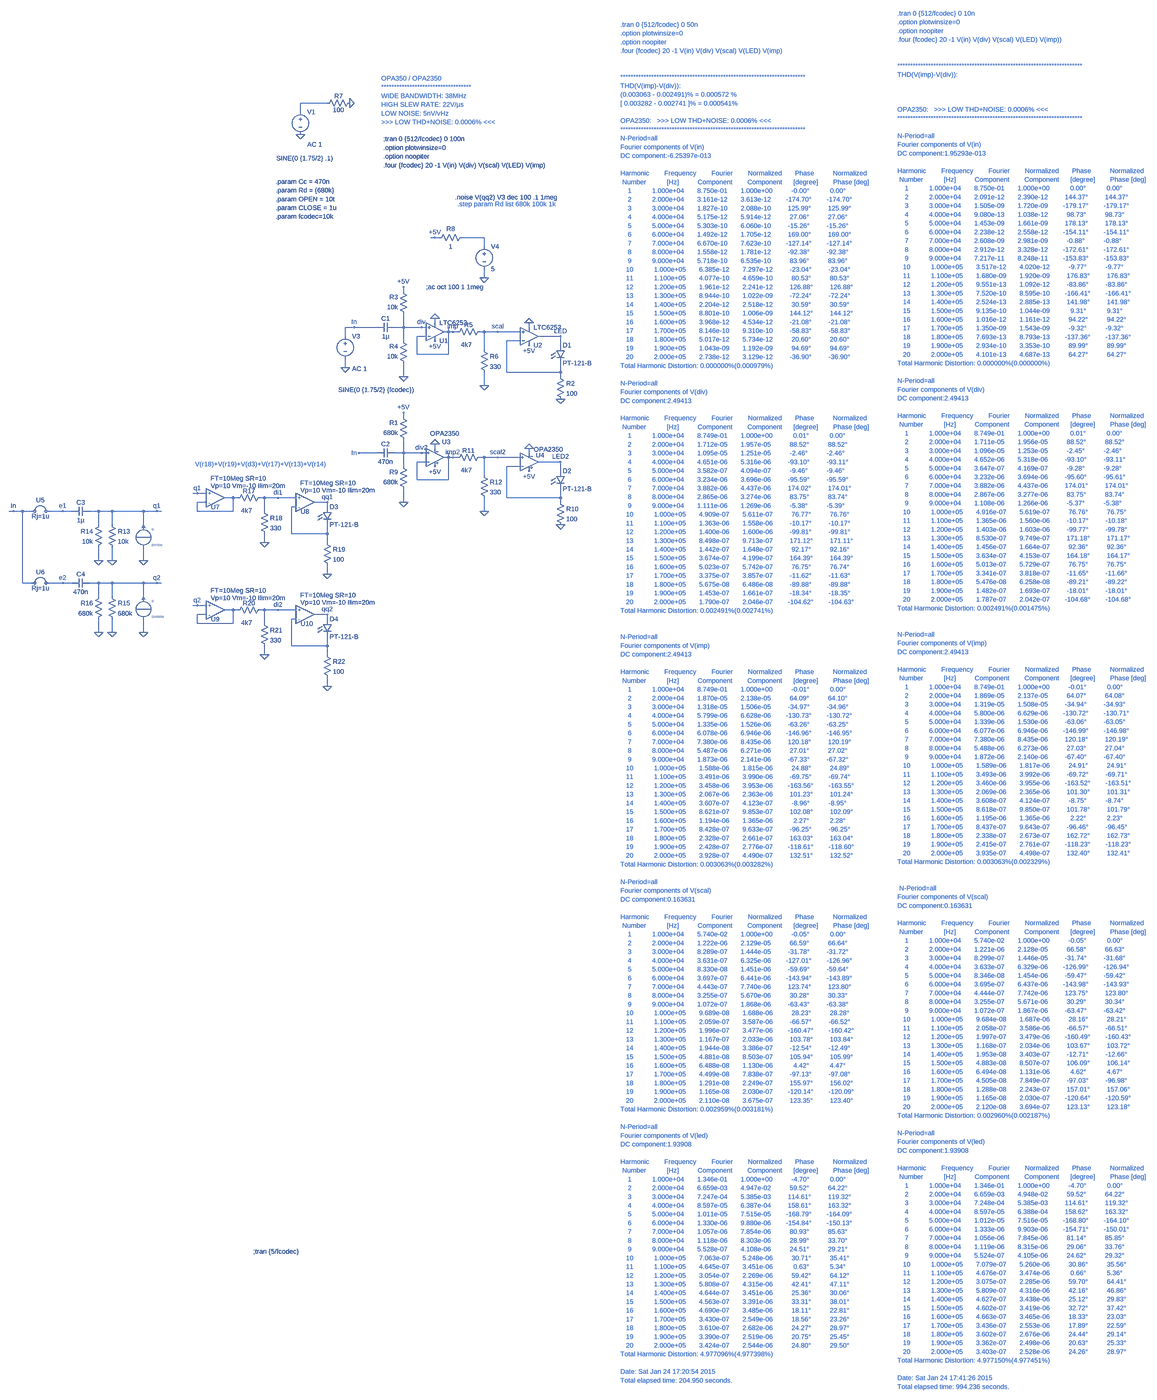
[diagram p0: schematic ALDO_LED_Driver_opa2350_thd.asc, whole sheet]
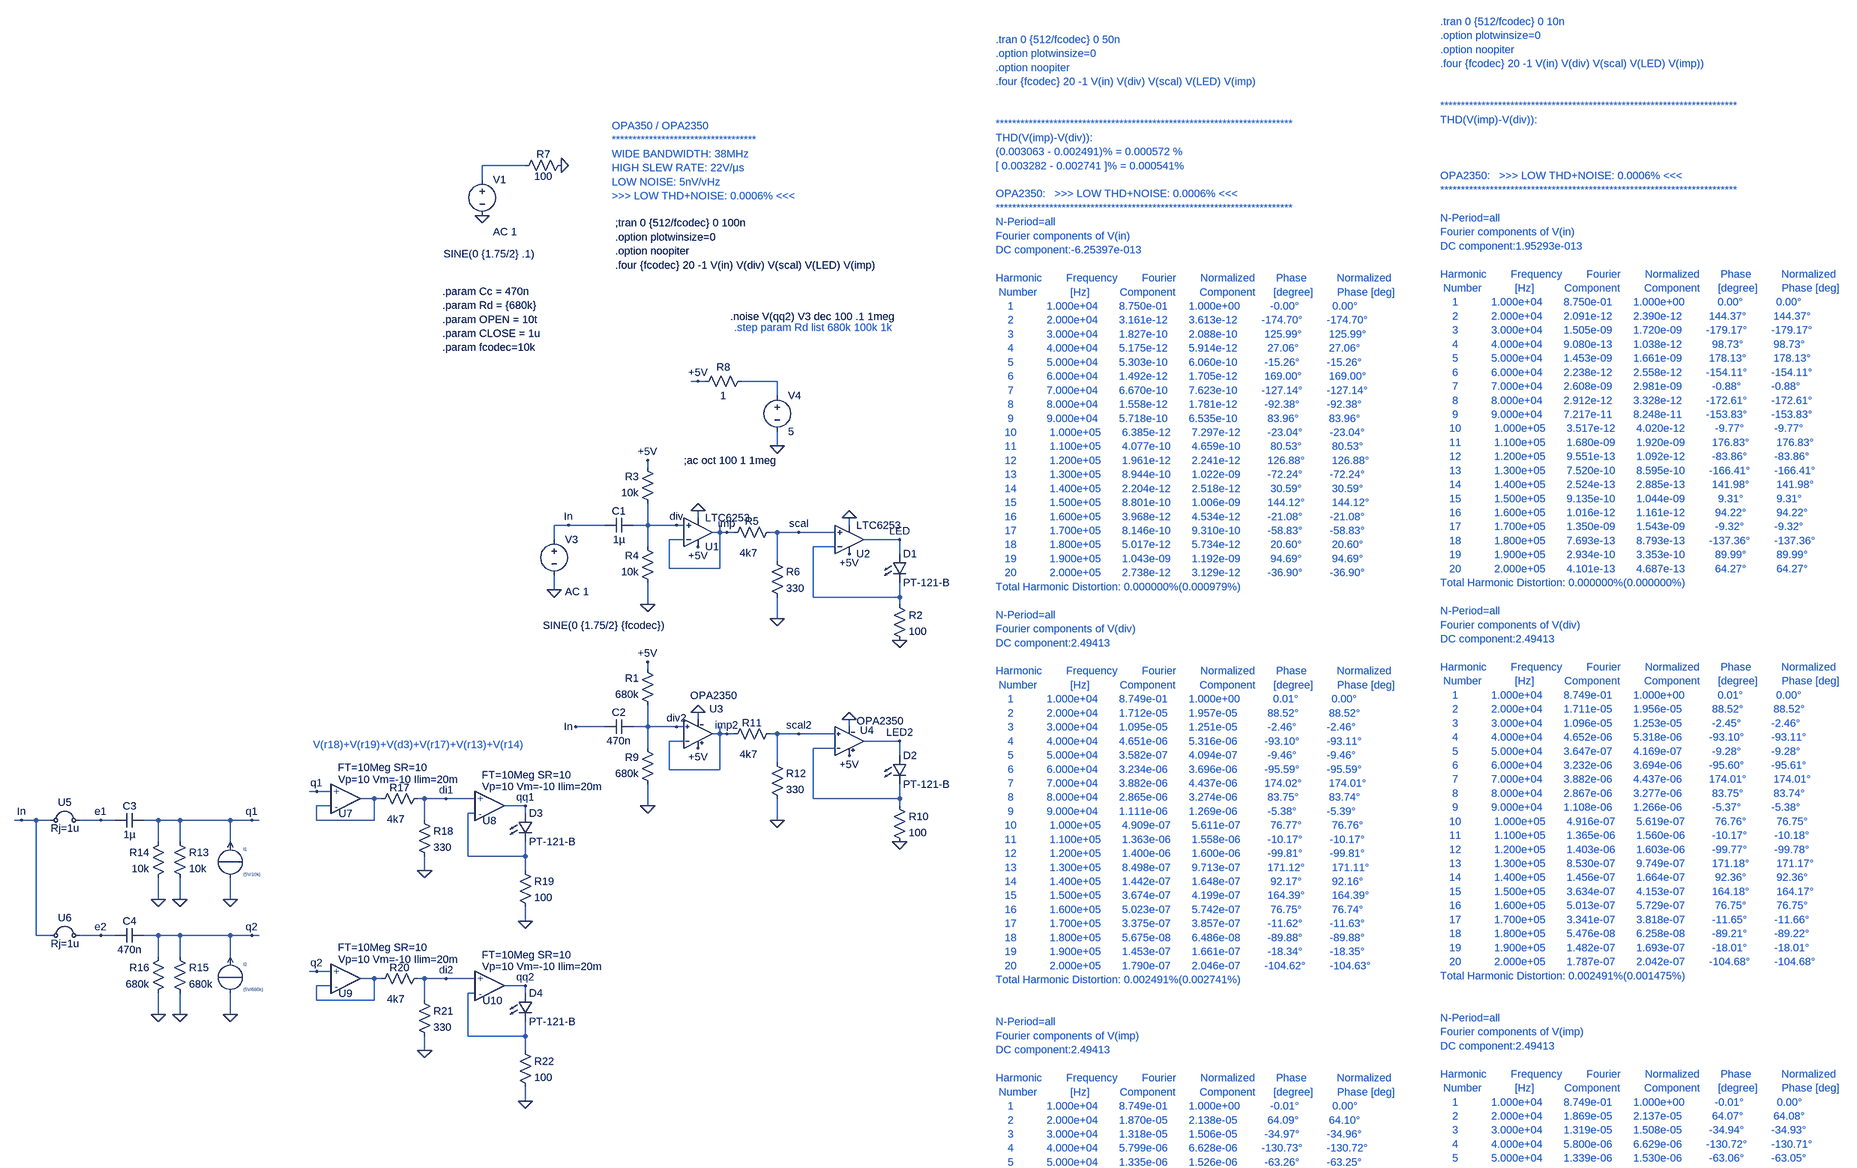
[diagram p1: schematic ALDO_LED_Driver_opa2350_thd.asc, part, row 1 of 2, column 1 of 1]
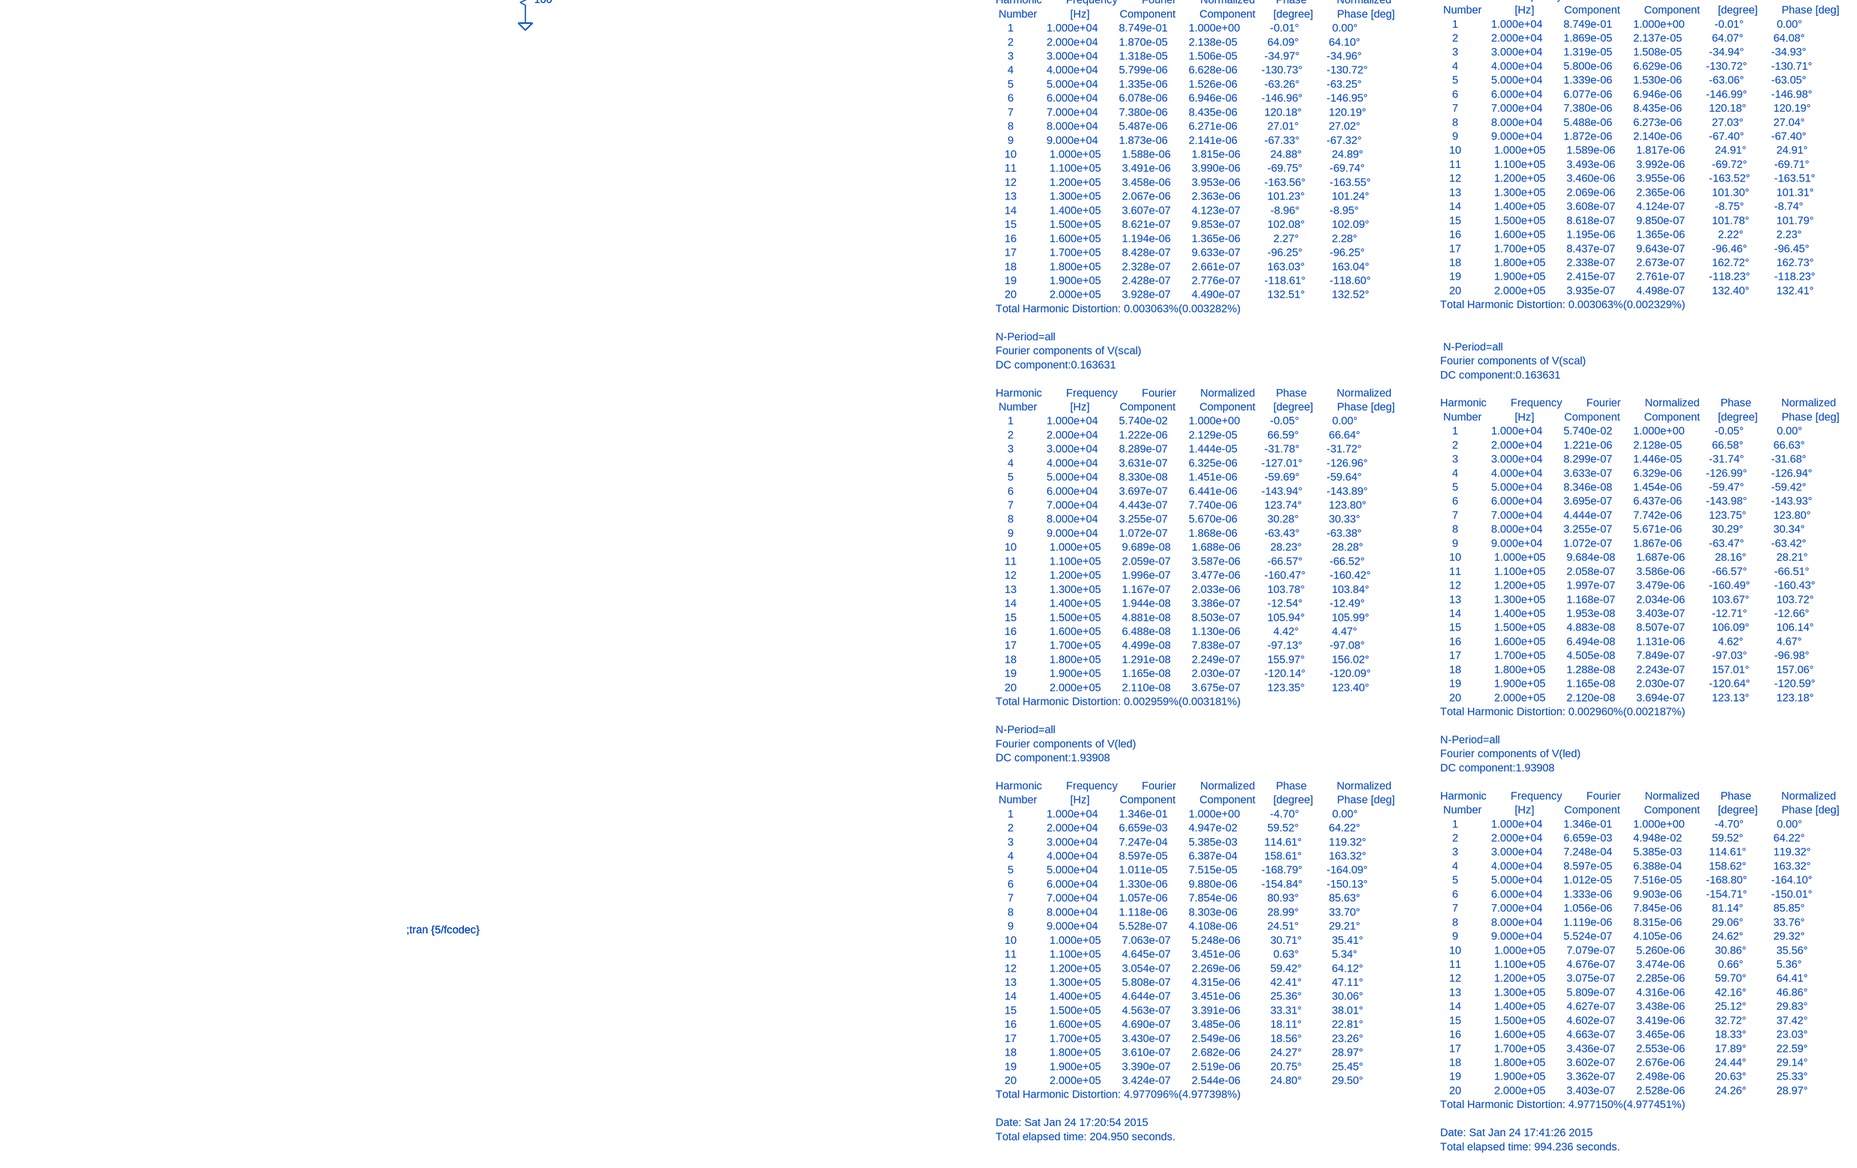
[diagram p2: schematic ALDO_LED_Driver_opa2350_thd.asc, part, row 2 of 2, column 1 of 1]
* ALDO_LED_Driver_opa2350_thd.asc
V3 In 0 SINE(0 {1.75/2} {fcodec}) AC 1
V4 N002 0 5
R3 div +5V 10k
D1 LED N003 PT-121-B
R2 N003 0 100
C1 div In 1µ
R5 imp scal 4k7
R6 scal 0 330
V1 N001 0 SINE(0 {1.75/2} .1) AC 1
R7 0 N001 100
R8 +5V N002 1
R1 div2 +5V 680k
R9 0 div2 680k
R10 N004 0 100
C2 div2 In 470n
R11 imp2 scal2 4k7
R12 scal2 0 330
D2 LED2 N004 PT-121-B
XU3 div2 imp2 +5V 0 imp2 OPA2350 OPA2350  ; pins In+ In- V+ V- OUT
XU4 scal2 N004 +5V 0 LED2 OPA2350 OPA2350  ; pins In+ In- V+ V- OUT
R4 0 div 10k
* U1: LTC6253 (symbol Opamps\LTC6253 not available, pins judged from their places): In+=div In-=imp V+=+5V V-=0 OUT=imp
* U2: LTC6253 (symbol Opamps\LTC6253 not available, pins judged from their places): In+=scal In-=N003 V+=+5V V-=0 OUT=LED
C3 q1 e1 1µ
I1 0 q1 {5V/10k}
C4 q2 e2 470n
I2 0 q2 {5V/680k}
R13 q1 0 10k
R14 q1 0 10k
R15 q2 0 680k
R16 q2 0 680k
XU5 In e1 jumperResistor Rin=1t Rout=1t Rj=1u  ; pins + -
XU6 In e2 jumperResistor Rin=1t Rout=1t Rj=1u  ; pins + -
XU7 q1 N005 N005 opamp_param_3 Vp=10 Vm=-10 Ilim=20m FT=10Meg SR=10 Vos=0 A0=100k phir=45 en=0 enk=0 in=0 ink=0 Rin=500Meg  ; pins In+ In- OUT
XU8 di1 N006 qq1 opamp_param_3 Vp=10 Vm=-10 Ilim=20m FT=10Meg SR=10 Vos=0 A0=100k phir=45 en=0 enk=0 in=0 ink=0 Rin=500Meg  ; pins In+ In- OUT
D3 qq1 N006 PT-121-B
R17 N005 di1 4k7
R18 di1 0 330
R19 N006 0 100
XU9 q2 N007 N007 opamp_param_3 Vp=10 Vm=-10 Ilim=20m FT=10Meg SR=10 Vos=0 A0=100k phir=45 en=0 enk=0 in=0 ink=0 Rin=500Meg  ; pins In+ In- OUT
XU10 di2 N008 qq2 opamp_param_3 Vp=10 Vm=-10 Ilim=20m FT=10Meg SR=10 Vos=0 A0=100k phir=45 en=0 enk=0 in=0 ink=0 Rin=500Meg  ; pins In+ In- OUT
D4 qq2 N008 PT-121-B
R20 N007 di2 4k7
R21 di2 0 330
R22 N008 0 100
.model D D
.lib standard.dio
.param Cc = 470n
.param Rd = {680k}
.param OPEN = 10t
.param CLOSE = 1u
.param fcodec=10k
;tran 0 {512/fcodec} 0 100n
.option plotwinsize=0
.option noopiter
.four {fcodec} 20 -1 V(in) V(div) V(scal) V(LED) V(imp)
* .tran 0 {512/fcodec} 0 50n
* .option plotwinsize=0
* .option noopiter
* .four {fcodec} 20 -1 V(in) V(div) V(scal) V(LED) V(imp)
* ************************************************************************
* THD(V(imp)-V(div)):
* (0.003063 - 0.002491)% = 0.000572 %
* [ 0.003282 - 0.002741 ]% = 0.000541%
* OPA2350:   >>> LOW THD+NOISE: 0.0006% <<<
* ************************************************************************
* N-Period=all
* Fourier components of V(in)
* DC component:-6.25397e-013
* Harmonic        Frequency        Fourier        Normalized       Phase          Normalized
*  Number           [Hz]          Component        Component      [degree]        Phase [deg]
*     1           1.000e+04       8.750e-01       1.000e+00          -0.00°           0.00°
*     2           2.000e+04       3.161e-12       3.613e-12        -174.70°        -174.70°
*     3           3.000e+04       1.827e-10       2.088e-10         125.99°         125.99°
*     4           4.000e+04       5.175e-12       5.914e-12          27.06°          27.06°
*     5           5.000e+04       5.303e-10       6.060e-10         -15.26°         -15.26°
*     6           6.000e+04       1.492e-12       1.705e-12         169.00°         169.00°
*     7           7.000e+04       6.670e-10       7.623e-10        -127.14°        -127.14°
*     8           8.000e+04       1.558e-12       1.781e-12         -92.38°         -92.38°
*     9           9.000e+04       5.718e-10       6.535e-10          83.96°          83.96°
*    10           1.000e+05       6.385e-12       7.297e-12         -23.04°         -23.04°
*    11           1.100e+05       4.077e-10       4.659e-10          80.53°          80.53°
*    12           1.200e+05       1.961e-12       2.241e-12         126.88°         126.88°
*    13           1.300e+05       8.944e-10       1.022e-09         -72.24°         -72.24°
*    14           1.400e+05       2.204e-12       2.518e-12          30.59°          30.59°
*    15           1.500e+05       8.801e-10       1.006e-09         144.12°         144.12°
*    16           1.600e+05       3.968e-12       4.534e-12         -21.08°         -21.08°
*    17           1.700e+05       8.146e-10       9.310e-10         -58.83°         -58.83°
*    18           1.800e+05       5.017e-12       5.734e-12          20.60°          20.60°
*    19           1.900e+05       1.043e-09       1.192e-09          94.69°          94.69°
*    20           2.000e+05       2.738e-12       3.129e-12         -36.90°         -36.90°
* Total Harmonic Distortion: 0.000000%(0.000979%)
* N-Period=all
* Fourier components of V(div)
* DC component:2.49413
* Harmonic        Frequency        Fourier        Normalized       Phase          Normalized
*  Number           [Hz]          Component        Component      [degree]        Phase [deg]
*     1           1.000e+04       8.749e-01       1.000e+00           0.01°           0.00°
*     2           2.000e+04       1.712e-05       1.957e-05          88.52°          88.52°
*     3           3.000e+04       1.095e-05       1.251e-05          -2.46°          -2.46°
*     4           4.000e+04       4.651e-06       5.316e-06         -93.10°         -93.11°
*     5           5.000e+04       3.582e-07       4.094e-07          -9.46°          -9.46°
*     6           6.000e+04       3.234e-06       3.696e-06         -95.59°         -95.59°
*     7           7.000e+04       3.882e-06       4.437e-06         174.02°         174.01°
*     8           8.000e+04       2.865e-06       3.274e-06          83.75°          83.74°
*     9           9.000e+04       1.111e-06       1.269e-06          -5.38°          -5.39°
*    10           1.000e+05       4.909e-07       5.611e-07          76.77°          76.76°
*    11           1.100e+05       1.363e-06       1.558e-06         -10.17°         -10.17°
*    12           1.200e+05       1.400e-06       1.600e-06         -99.81°         -99.81°
*    13           1.300e+05       8.498e-07       9.713e-07         171.12°         171.11°
*    14           1.400e+05       1.442e-07       1.648e-07          92.17°          92.16°
*    15           1.500e+05       3.674e-07       4.199e-07         164.39°         164.39°
*    16           1.600e+05       5.023e-07       5.742e-07          76.75°          76.74°
*    17           1.700e+05       3.375e-07       3.857e-07         -11.62°         -11.63°
*    18           1.800e+05       5.675e-08       6.486e-08         -89.88°         -89.88°
*    19           1.900e+05       1.453e-07       1.661e-07         -18.34°         -18.35°
*    20           2.000e+05       1.790e-07       2.046e-07        -104.62°        -104.63°
* Total Harmonic Distortion: 0.002491%(0.002741%)
* N-Period=all
* Fourier components of V(imp)
* DC component:2.49413
* Harmonic        Frequency        Fourier        Normalized       Phase          Normalized
*  Number           [Hz]          Component        Component      [degree]        Phase [deg]
*     1           1.000e+04       8.749e-01       1.000e+00          -0.01°           0.00°
*     2           2.000e+04       1.870e-05       2.138e-05          64.09°          64.10°
*     3           3.000e+04       1.318e-05       1.506e-05         -34.97°         -34.96°
*     4           4.000e+04       5.799e-06       6.628e-06        -130.73°        -130.72°
*     5           5.000e+04       1.335e-06       1.526e-06         -63.26°         -63.25°
*     6           6.000e+04       6.078e-06       6.946e-06        -146.96°        -146.95°
*     7           7.000e+04       7.380e-06       8.435e-06         120.18°         120.19°
*     8           8.000e+04       5.487e-06       6.271e-06          27.01°          27.02°
*     9           9.000e+04       1.873e-06       2.141e-06         -67.33°         -67.32°
*    10           1.000e+05       1.588e-06       1.815e-06          24.88°          24.89°
*    11           1.100e+05       3.491e-06       3.990e-06         -69.75°         -69.74°
*    12           1.200e+05       3.458e-06       3.953e-06        -163.56°        -163.55°
*    13           1.300e+05       2.067e-06       2.363e-06         101.23°         101.24°
*    14           1.400e+05       3.607e-07       4.123e-07          -8.96°          -8.95°
*    15           1.500e+05       8.621e-07       9.853e-07         102.08°         102.09°
*    16           1.600e+05       1.194e-06       1.365e-06           2.27°           2.28°
*    17           1.700e+05       8.428e-07       9.633e-07         -96.25°         -96.25°
*    18           1.800e+05       2.328e-07       2.661e-07         163.03°         163.04°
*    19           1.900e+05       2.428e-07       2.776e-07        -118.61°        -118.60°
*    20           2.000e+05       3.928e-07       4.490e-07         132.51°         132.52°
* Total Harmonic Distortion: 0.003063%(0.003282%)
* N-Period=all
* Fourier components of V(scal)
* DC component:0.163631
* Harmonic        Frequency        Fourier        Normalized       Phase          Normalized
*  Number           [Hz]          Component        Component      [degree]        Phase [deg]
*     1           1.000e+04       5.740e-02       1.000e+00          -0.05°           0.00°
*     2           2.000e+04       1.222e-06       2.129e-05          66.59°          66.64°
*     3           3.000e+04       8.289e-07       1.444e-05         -31.78°         -31.72°
*     4           4.000e+04       3.631e-07       6.325e-06        -127.01°        -126.96°
*     5           5.000e+04       8.330e-08       1.451e-06         -59.69°         -59.64°
*     6           6.000e+04       3.697e-07       6.441e-06        -143.94°        -143.89°
*     7           7.000e+04       4.443e-07       7.740e-06         123.74°         123.80°
*     8           8.000e+04       3.255e-07       5.670e-06          30.28°          30.33°
*     9           9.000e+04       1.072e-07       1.868e-06         -63.43°         -63.38°
*    10           1.000e+05       9.689e-08       1.688e-06          28.23°          28.28°
*    11           1.100e+05       2.059e-07       3.587e-06         -66.57°         -66.52°
*    12           1.200e+05       1.996e-07       3.477e-06        -160.47°        -160.42°
*    13           1.300e+05       1.167e-07       2.033e-06         103.78°         103.84°
*    14           1.400e+05       1.944e-08       3.386e-07         -12.54°         -12.49°
*    15           1.500e+05       4.881e-08       8.503e-07         105.94°         105.99°
*    16           1.600e+05       6.488e-08       1.130e-06           4.42°           4.47°
*    17           1.700e+05       4.499e-08       7.838e-07         -97.13°         -97.08°
*    18           1.800e+05       1.291e-08       2.249e-07         155.97°         156.02°
*    19           1.900e+05       1.165e-08       2.030e-07        -120.14°        -120.09°
*    20           2.000e+05       2.110e-08       3.675e-07         123.35°         123.40°
* Total Harmonic Distortion: 0.002959%(0.003181%)
* N-Period=all
* Fourier components of V(led)
* DC component:1.93908
* Harmonic        Frequency        Fourier        Normalized       Phase          Normalized
*  Number           [Hz]          Component        Component      [degree]        Phase [deg]
*     1           1.000e+04       1.346e-01       1.000e+00          -4.70°           0.00°
*     2           2.000e+04       6.659e-03       4.947e-02          59.52°          64.22°
*     3           3.000e+04       7.247e-04       5.385e-03         114.61°         119.32°
*     4           4.000e+04       8.597e-05       6.387e-04         158.61°         163.32°
*     5           5.000e+04       1.011e-05       7.515e-05        -168.79°        -164.09°
*     6           6.000e+04       1.330e-06       9.880e-06        -154.84°        -150.13°
*     7           7.000e+04       1.057e-06       7.854e-06          80.93°          85.63°
*     8           8.000e+04       1.118e-06       8.303e-06          28.99°          33.70°
*     9           9.000e+04       5.528e-07       4.108e-06          24.51°          29.21°
*    10           1.000e+05       7.063e-07       5.248e-06          30.71°          35.41°
*    11           1.100e+05       4.645e-07       3.451e-06           0.63°           5.34°
*    12           1.200e+05       3.054e-07       2.269e-06          59.42°          64.12°
*    13           1.300e+05       5.808e-07       4.315e-06          42.41°          47.11°
*    14           1.400e+05       4.644e-07       3.451e-06          25.36°          30.06°
*    15           1.500e+05       4.563e-07       3.391e-06          33.31°          38.01°
*    16           1.600e+05       4.690e-07       3.485e-06          18.11°          22.81°
*    17           1.700e+05       3.430e-07       2.549e-06          18.56°          23.26°
*    18           1.800e+05       3.610e-07       2.682e-06          24.27°          28.97°
*    19           1.900e+05       3.390e-07       2.519e-06          20.75°          25.45°
*    20           2.000e+05       3.424e-07       2.544e-06          24.80°          29.50°
* Total Harmonic Distortion: 4.977096%(4.977398%)
* Date: Sat Jan 24 17:20:54 2015
* Total elapsed time: 204.950 seconds.
* OPA350 / OPA2350
* ***********************************
* WIDE BANDWIDTH: 38MHz
* HIGH SLEW RATE: 22V/µs
* LOW NOISE: 5nV/vHz
* >>> LOW THD+NOISE: 0.0006% <<<
* .tran 0 {512/fcodec} 0 10n
* .option plotwinsize=0
* .option noopiter
* .four {fcodec} 20 -1 V(in) V(div) V(scal) V(LED) V(imp))
* ************************************************************************
* THD(V(imp)-V(div)):
* OPA2350:   >>> LOW THD+NOISE: 0.0006% <<<
* ************************************************************************
* N-Period=all
* Fourier components of V(in)
* DC component:1.95293e-013
* Harmonic        Frequency        Fourier        Normalized       Phase          Normalized
*  Number           [Hz]          Component        Component      [degree]        Phase [deg]
*     1           1.000e+04       8.750e-01       1.000e+00           0.00°           0.00°
*     2           2.000e+04       2.091e-12       2.390e-12         144.37°         144.37°
*     3           3.000e+04       1.505e-09       1.720e-09        -179.17°        -179.17°
*     4           4.000e+04       9.080e-13       1.038e-12          98.73°          98.73°
*     5           5.000e+04       1.453e-09       1.661e-09         178.13°         178.13°
*     6           6.000e+04       2.238e-12       2.558e-12        -154.11°        -154.11°
*     7           7.000e+04       2.608e-09       2.981e-09          -0.88°          -0.88°
*     8           8.000e+04       2.912e-12       3.328e-12        -172.61°        -172.61°
*     9           9.000e+04       7.217e-11       8.248e-11        -153.83°        -153.83°
*    10           1.000e+05       3.517e-12       4.020e-12          -9.77°          -9.77°
*    11           1.100e+05       1.680e-09       1.920e-09         176.83°         176.83°
*    12           1.200e+05       9.551e-13       1.092e-12         -83.86°         -83.86°
*    13           1.300e+05       7.520e-10       8.595e-10        -166.41°        -166.41°
*    14           1.400e+05       2.524e-13       2.885e-13         141.98°         141.98°
*    15           1.500e+05       9.135e-10       1.044e-09           9.31°           9.31°
*    16           1.600e+05       1.016e-12       1.161e-12          94.22°          94.22°
*    17           1.700e+05       1.350e-09       1.543e-09          -9.32°          -9.32°
*    18           1.800e+05       7.693e-13       8.793e-13        -137.36°        -137.36°
*    19           1.900e+05       2.934e-10       3.353e-10          89.99°          89.99°
*    20           2.000e+05       4.101e-13       4.687e-13          64.27°          64.27°
* Total Harmonic Distortion: 0.000000%(0.000000%)
* N-Period=all
* Fourier components of V(div)
* DC component:2.49413
* Harmonic        Frequency        Fourier        Normalized       Phase          Normalized
*  Number           [Hz]          Component        Component      [degree]        Phase [deg]
*     1           1.000e+04       8.749e-01       1.000e+00           0.01°           0.00°
*     2           2.000e+04       1.711e-05       1.956e-05          88.52°          88.52°
*     3           3.000e+04       1.096e-05       1.253e-05          -2.45°          -2.46°
*     4           4.000e+04       4.652e-06       5.318e-06         -93.10°         -93.11°
*     5           5.000e+04       3.647e-07       4.169e-07          -9.28°          -9.28°
*     6           6.000e+04       3.232e-06       3.694e-06         -95.60°         -95.61°
*     7           7.000e+04       3.882e-06       4.437e-06         174.01°         174.01°
*     8           8.000e+04       2.867e-06       3.277e-06          83.75°          83.74°
*     9           9.000e+04       1.108e-06       1.266e-06          -5.37°          -5.38°
*    10           1.000e+05       4.916e-07       5.619e-07          76.76°          76.75°
*    11           1.100e+05       1.365e-06       1.560e-06         -10.17°         -10.18°
*    12           1.200e+05       1.403e-06       1.603e-06         -99.77°         -99.78°
*    13           1.300e+05       8.530e-07       9.749e-07         171.18°         171.17°
*    14           1.400e+05       1.456e-07       1.664e-07          92.36°          92.36°
*    15           1.500e+05       3.634e-07       4.153e-07         164.18°         164.17°
*    16           1.600e+05       5.013e-07       5.729e-07          76.75°          76.75°
*    17           1.700e+05       3.341e-07       3.818e-07         -11.65°         -11.66°
*    18           1.800e+05       5.476e-08       6.258e-08         -89.21°         -89.22°
*    19           1.900e+05       1.482e-07       1.693e-07         -18.01°         -18.01°
*    20           2.000e+05       1.787e-07       2.042e-07        -104.68°        -104.68°
* Total Harmonic Distortion: 0.002491%(0.001475%)
* N-Period=all
* Fourier components of V(imp)
* DC component:2.49413
* Harmonic        Frequency        Fourier        Normalized       Phase          Normalized
*  Number           [Hz]          Component        Component      [degree]        Phase [deg]
*     1           1.000e+04       8.749e-01       1.000e+00          -0.01°           0.00°
*     2           2.000e+04       1.869e-05       2.137e-05          64.07°          64.08°
*     3           3.000e+04       1.319e-05       1.508e-05         -34.94°         -34.93°
*     4           4.000e+04       5.800e-06       6.629e-06        -130.72°        -130.71°
*     5           5.000e+04       1.339e-06       1.530e-06         -63.06°         -63.05°
*     6           6.000e+04       6.077e-06       6.946e-06        -146.99°        -146.98°
*     7           7.000e+04       7.380e-06       8.435e-06         120.18°         120.19°
*     8           8.000e+04       5.488e-06       6.273e-06          27.03°          27.04°
*     9           9.000e+04       1.872e-06       2.140e-06         -67.40°         -67.40°
*    10           1.000e+05       1.589e-06       1.817e-06          24.91°          24.91°
*    11           1.100e+05       3.493e-06       3.992e-06         -69.72°         -69.71°
*    12           1.200e+05       3.460e-06       3.955e-06        -163.52°        -163.51°
*    13           1.300e+05       2.069e-06       2.365e-06         101.30°         101.31°
*    14           1.400e+05       3.608e-07       4.124e-07          -8.75°          -8.74°
*    15           1.500e+05       8.618e-07       9.850e-07         101.78°         101.79°
*    16           1.600e+05       1.195e-06       1.365e-06           2.22°           2.23°
*    17           1.700e+05       8.437e-07       9.643e-07         -96.46°         -96.45°
*    18           1.800e+05       2.338e-07       2.673e-07         162.72°         162.73°
*    19           1.900e+05       2.415e-07       2.761e-07        -118.23°        -118.23°
*    20           2.000e+05       3.935e-07       4.498e-07         132.40°         132.41°
* Total Harmonic Distortion: 0.003063%(0.002329%)
*  N-Period=all
* Fourier components of V(scal)
* DC component:0.163631
* Harmonic        Frequency        Fourier        Normalized       Phase          Normalized
*  Number           [Hz]          Component        Component      [degree]        Phase [deg]
*     1           1.000e+04       5.740e-02       1.000e+00          -0.05°           0.00°
*     2           2.000e+04       1.221e-06       2.128e-05          66.58°          66.63°
*     3           3.000e+04       8.299e-07       1.446e-05         -31.74°         -31.68°
*     4           4.000e+04       3.633e-07       6.329e-06        -126.99°        -126.94°
*     5           5.000e+04       8.346e-08       1.454e-06         -59.47°         -59.42°
*     6           6.000e+04       3.695e-07       6.437e-06        -143.98°        -143.93°
*     7           7.000e+04       4.444e-07       7.742e-06         123.75°         123.80°
*     8           8.000e+04       3.255e-07       5.671e-06          30.29°          30.34°
*     9           9.000e+04       1.072e-07       1.867e-06         -63.47°         -63.42°
*    10           1.000e+05       9.684e-08       1.687e-06          28.16°          28.21°
*    11           1.100e+05       2.058e-07       3.586e-06         -66.57°         -66.51°
*    12           1.200e+05       1.997e-07       3.479e-06        -160.49°        -160.43°
*    13           1.300e+05       1.168e-07       2.034e-06         103.67°         103.72°
*    14           1.400e+05       1.953e-08       3.403e-07         -12.71°         -12.66°
*    15           1.500e+05       4.883e-08       8.507e-07         106.09°         106.14°
*    16           1.600e+05       6.494e-08       1.131e-06           4.62°           4.67°
*    17           1.700e+05       4.505e-08       7.849e-07         -97.03°         -96.98°
*    18           1.800e+05       1.288e-08       2.243e-07         157.01°         157.06°
*    19           1.900e+05       1.165e-08       2.030e-07        -120.64°        -120.59°
*    20           2.000e+05       2.120e-08       3.694e-07         123.13°         123.18°
* Total Harmonic Distortion: 0.002960%(0.002187%)
* N-Period=all
* Fourier components of V(led)
* DC component:1.93908
* Harmonic        Frequency        Fourier        Normalized       Phase          Normalized
*  Number           [Hz]          Component        Component      [degree]        Phase [deg]
*     1           1.000e+04       1.346e-01       1.000e+00          -4.70°           0.00°
*     2           2.000e+04       6.659e-03       4.948e-02          59.52°          64.22°
*     3           3.000e+04       7.248e-04       5.385e-03         114.61°         119.32°
*     4           4.000e+04       8.597e-05       6.388e-04         158.62°         163.32°
*     5           5.000e+04       1.012e-05       7.516e-05        -168.80°        -164.10°
*     6           6.000e+04       1.333e-06       9.903e-06        -154.71°        -150.01°
*     7           7.000e+04       1.056e-06       7.845e-06          81.14°          85.85°
*     8           8.000e+04       1.119e-06       8.315e-06          29.06°          33.76°
*     9           9.000e+04       5.524e-07       4.105e-06          24.62°          29.32°
*    10           1.000e+05       7.079e-07       5.260e-06          30.86°          35.56°
*    11           1.100e+05       4.676e-07       3.474e-06           0.66°           5.36°
*    12           1.200e+05       3.075e-07       2.285e-06          59.70°          64.41°
*    13           1.300e+05       5.809e-07       4.316e-06          42.16°          46.86°
*    14           1.400e+05       4.627e-07       3.438e-06          25.12°          29.83°
*    15           1.500e+05       4.602e-07       3.419e-06          32.72°          37.42°
*    16           1.600e+05       4.663e-07       3.465e-06          18.33°          23.03°
*    17           1.700e+05       3.436e-07       2.553e-06          17.89°          22.59°
*    18           1.800e+05       3.602e-07       2.676e-06          24.44°          29.14°
*    19           1.900e+05       3.362e-07       2.498e-06          20.63°          25.33°
*    20           2.000e+05       3.403e-07       2.528e-06          24.26°          28.97°
* Total Harmonic Distortion: 4.977150%(4.977451%)
* Date: Sat Jan 24 17:41:26 2015
* Total elapsed time: 994.236 seconds.
.noise V(qq2) V3 dec 100 .1 1meg
* .step param Rd list 680k 100k 1k
;tran {5/fcodec}
;ac oct 100 1 1meg
* V(r18)+V(r19)+V(d3)+V(r17)+V(r13)+V(r14)
.lib MDB_sub/OPA2350.sub
.lib MDB_sub/jumperRes.sub
.lib EIT_sub\opamp_parametrierbar.sub
.backanno
.end